# EAGLE design 5vSwitcher (EAGLE 6.5.0)
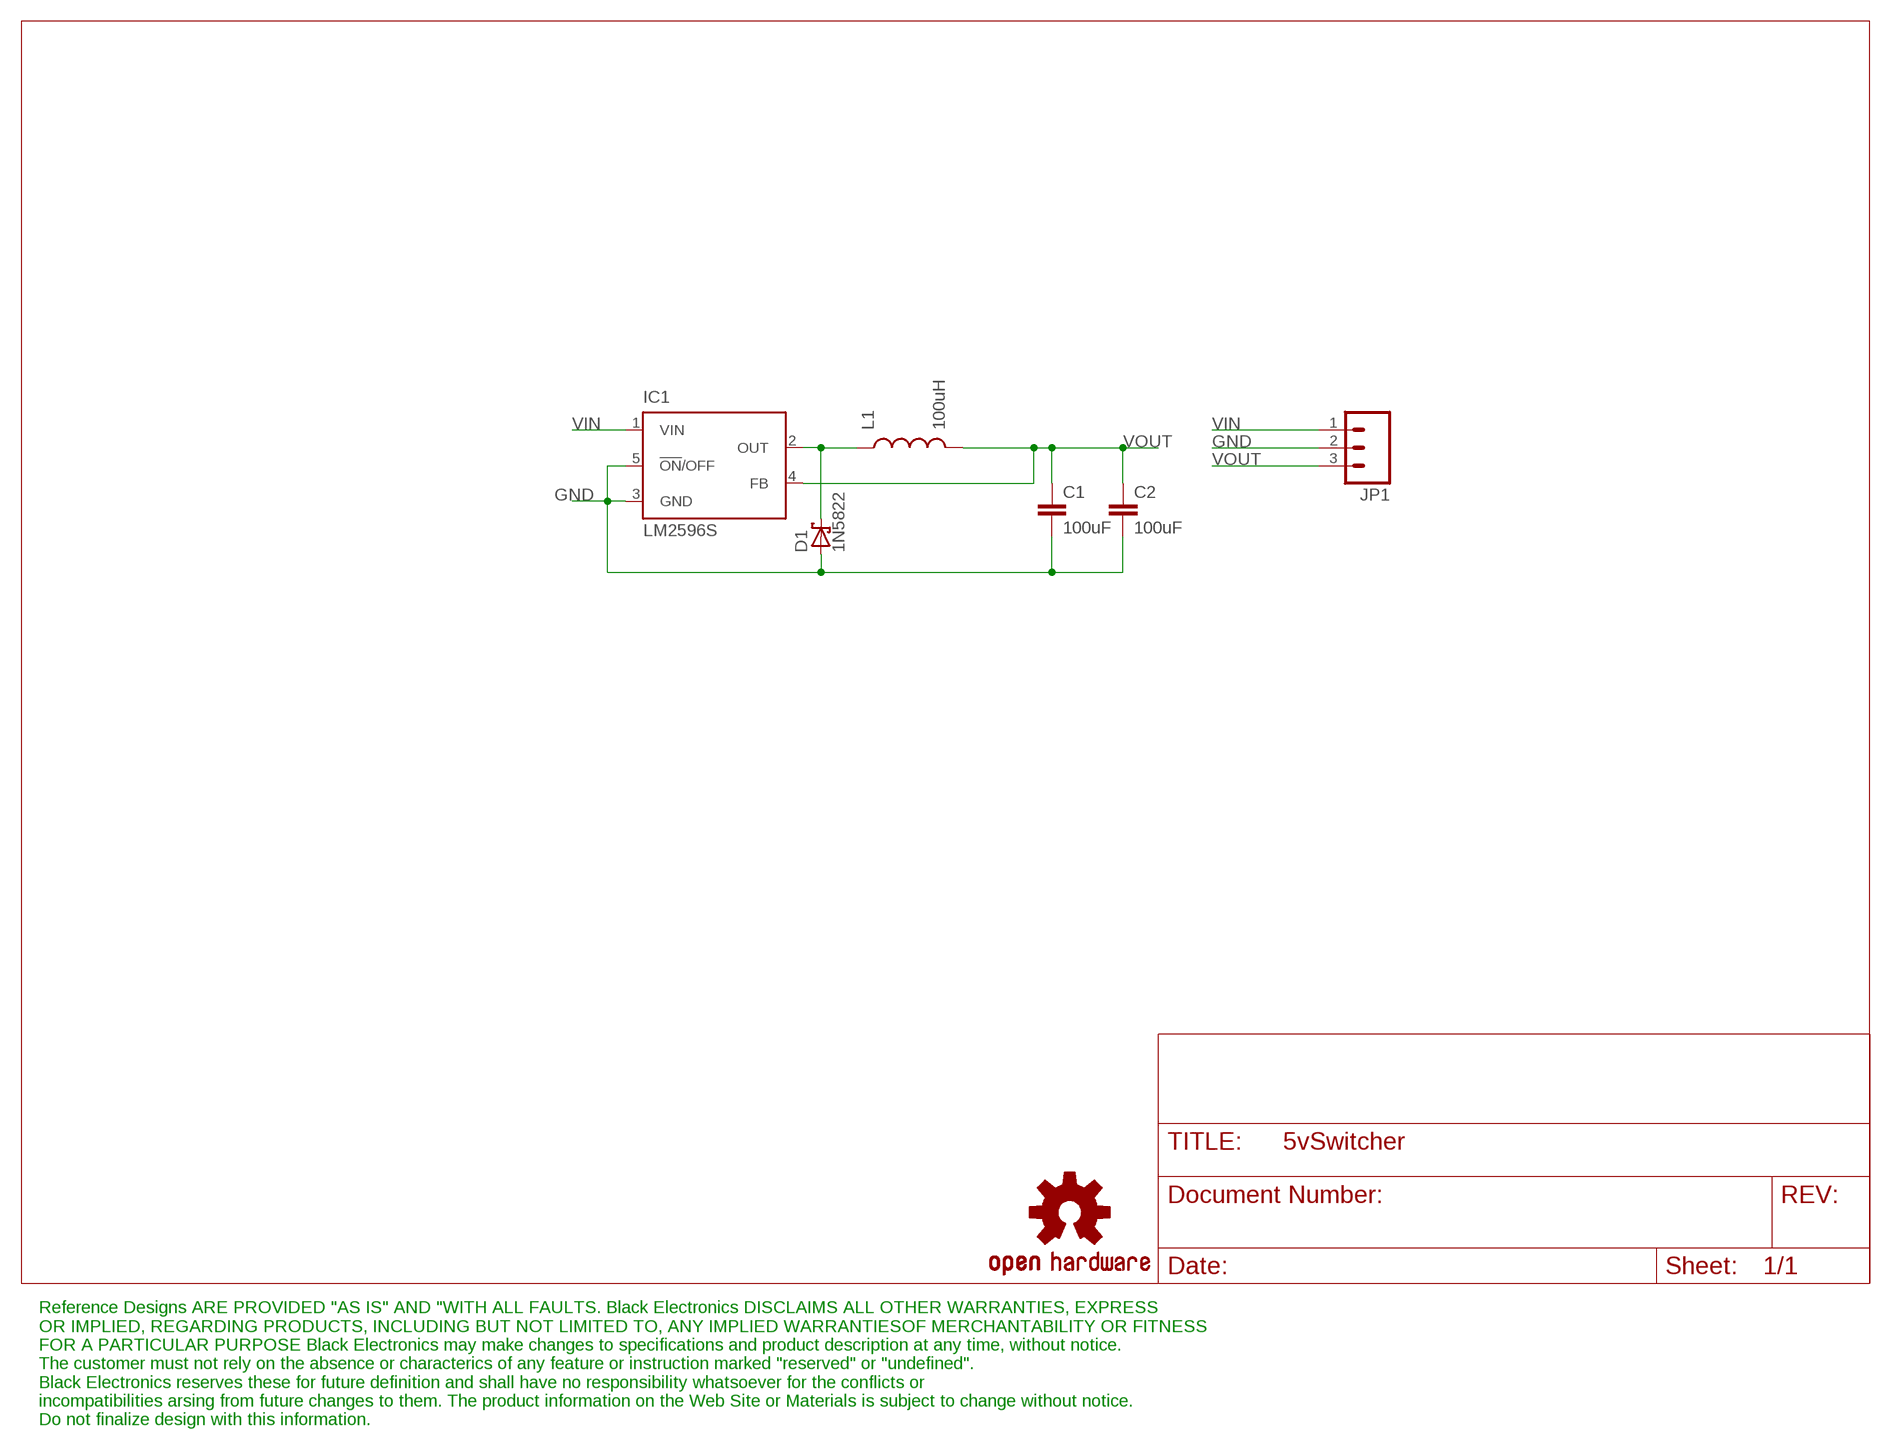
[diagram p0: schematic, sheet 1]

## Parts
C1  100uF  CAP0805  [0805]
C2  100uF  CAP0805  [0805]
D1  1N5822  SCHOTTKY-DIODESMC  [SMC]
IC1  LM2596S  [TO263-5]
JP1  M03PTH  [1X03]
L1  100uH  INDUCTOR1206H*  [INDUCTOR-1206]
U$1  OSHW-LOGOS  [OSHW-LOGO-S]

## Nets
GND: C1.2 C2.2 D1.A IC1.3(GND) IC1.5(!ON!/OFF) JP1.2
N$5: D1.C IC1.2(OUT) L1.P$1
VIN: IC1.1(VIN) JP1.1
VOUT: C1.1 C2.1 IC1.4(FB) JP1.3 L1.P$2

## Notes on the sheet
- Reference Designs ARE PROVIDED "AS IS" AND "WITH ALL FAULTS. Black Electronics DISCLAIMS ALL OTHER WARRANTIES, EXPRESS 
  OR IMPLIED, REGARDING PRODUCTS, INCLUDING BUT NOT LIMITED TO, ANY IMPLIED WARRANTIESOF MERCHANTABILITY OR FITNESS
  FOR A PARTICULAR PURPOSE Black Electronics may make changes to specifications and product description at any time, without notice.
  The customer must not rely on the absence or characterics of any feature or instruction marked "reserved" or "undefined".
  Black Electronics reserves these for future definition and shall have no responsibility whatsoever for the conflicts or 
  incompatibilities arsing from future changes to them. The product information on the Web Site or Materials is subject to change without notice.
  Do not finalize design with this information.

## Library data of the parts
C1 C2 = SparkFun:CAP: Capacitor Standard 0603 ceramic capacitor, and 0.1" leaded capacitor.
D1 = diode:SCHOTTKY-DIODE: Schottky Diode
IC1 = national-semiconductor:LM2596: SIMPLE SWITCHER® Power Converter 150 kHz 3A Step-Down Voltage Regulator Source: http://www.national.com/ds/LM/LM2596.pdf; MF: NATIONAL SEMICONDUCTOR; MPN: LM2596S-ADJ/NOPB; OC_FARNELL: 9494367; OC_NEWARK: 41K3842
JP1 = SparkFun:M03: Header 3 Standard 3-pin 0.1" header. Use with straight break away headers (SKU : PRT-00116), right angle break away headers (PRT-00553), swiss pins (PRT-00743), machine pins (PRT-00117), and female headers (PRT-00115). Molex polarized connector foot print use with SKU : PRT-08232 with associated crimp pins and housings.
L1 = SparkFun:INDUCTOR: Inductors Basic Inductor/Choke - 0603 and 1206. Footprints are not proven and vary greatly between part numbers.
U$1 = SparkFun:OSHW-LOGO: Open Source Hardware Logo This logo indicates the piece of hardware it is found on incorporates a OSHW license and/or adheres to the definition of open source hardware found here: http://freedomdefined.org/OSHW

## Board
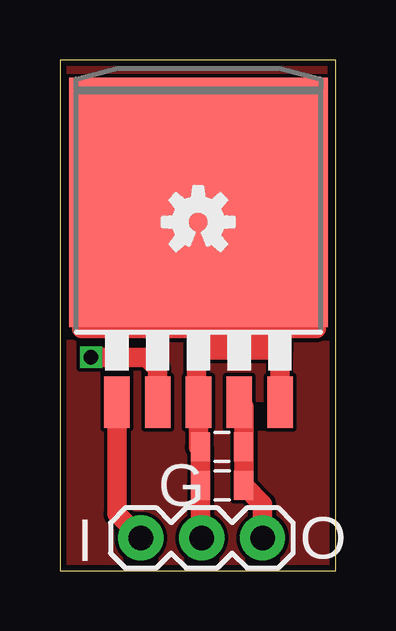
[diagram p1: board, top side]
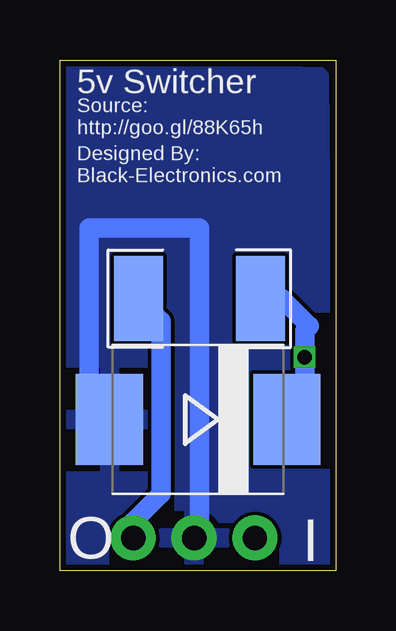
[diagram p2: board, bottom side, seen from below]

Size 11.5 x 21.3 mm. Coordinates in mm from the lower left corner, seen from the top.
Outline: 0,0 11.5,0 11.5,21.3 0,21.3 0,0
Copper layers (1*16): Top 0.035mm / dielectric 1.5mm / Bottom 0.035mm
Design rules "Fusion_eagle_rule_v1.1": minimum track width 6mil, minimum drill 12mil, track to track 6mil, track to pad 6mil, pad to pad 6mil, via to via 6mil, smd to smd 0mil, copper to edge 10mil, drill to drill 10mil, minimum pad ring 10mil, minimum via ring 6mil, stop-mask expansion 2mil, vias tented up to drill 100mil, thermal gap 10mil

### Footprints (pad centres in the part's own frame; a part is rotated, then mirrored left to right if it is on the bottom)
0805 = smd 0.8 x 1.2: 1 -0.9,0; 2 0.9,0
SMC = smd 2.8 x 3.8: A 3.7,0; C -3.7,0
TO263-5 = smd 1.067 x 2.159: 1 -3.404,-5.791; 2 -1.702,-5.791; 3 0,-5.791; 4 1.702,-5.791; 5 3.404,-5.791 | smd 10.8 x 10.41: 6 0,2.54
1X03 = drill 1.016 pad 1.88: 1 0,0; 2 2.54,0; 3 5.08,0
INDUCTOR-1206 = smd 2.032 x 3.556: P$1 -2.54,0; P$2 2.54,0

### Placement (x,y rotation side)
C1  6.76,5.16 180 top
C2  6.77,3.56 180 top
D1  5.75,6.31 180 bottom
IC1  5.78,12.82 0 top
JP1  3.38,1.37 0 top
L1  5.69,11.35 180 bottom
U$1  5.77,14.54 0 top

### Tracks (layer width: path | path; a pad name or v marks a point on that pad's centre or on a via)
GND
  Top 0.813: JP1.2 5.87,1.37 C2.2 C1.2 5.78,5.16 IC1.3 5.7,7.03 5.7,9.2 9.18,9.2 IC1.5
  Bottom 0.813: D1.A 10.3,7.16 10.3,14.3 5.7,14.3 5.7,1.37 JP1.2
  pour Bottom: 0.5,0.4 11.1,0.6 11,20.9 0.7,20.6
N$1
  pour Top: 0.5,0.2 11.2,0.2 11,20.9 0.3,21 0.3,0.6
N$2
  Top 0.813: 5.9,9.3 5.9,10.5 9,10.5 9,9.4 8.7,9.4 8.7,9.8 6.5,9.8
N$3
  Top 0.813: 0.9,10.1 10.7,10.1 10.7,10.2
N$5  (via drill 0.6)
  Top 0.813: IC1.2 4.08,8.42 3.6,8.9 v1.3,8.9
  Bottom 0.813: D1.C 1.3,7.06 v1.3,8.9 1.3,10 1.1,10.2 2.25,11.35 L1.P$1
VIN
  Top 0.813: IC1.1 2.38,2.37 JP1.1
VOUT
  Top 0.813: JP1.3 8.46,2.77 C2.1 7.67,4.6 C1.1 | C1.1 | IC1.4 7.67,6.84 C1.1
  Bottom 0.813: L1.P$2 7.3,10.42 7.3,3.2 8.46,2.04 JP1.3

### Text on the board
tPlace: G | I | O
bPlace: 5v Switcher | Source: / http://goo.gl/88K65h | Designed By: / Black-Electronics.com | I | O